# EAGLE design STorM32 NT Display v12 (EAGLE 7.5.0)
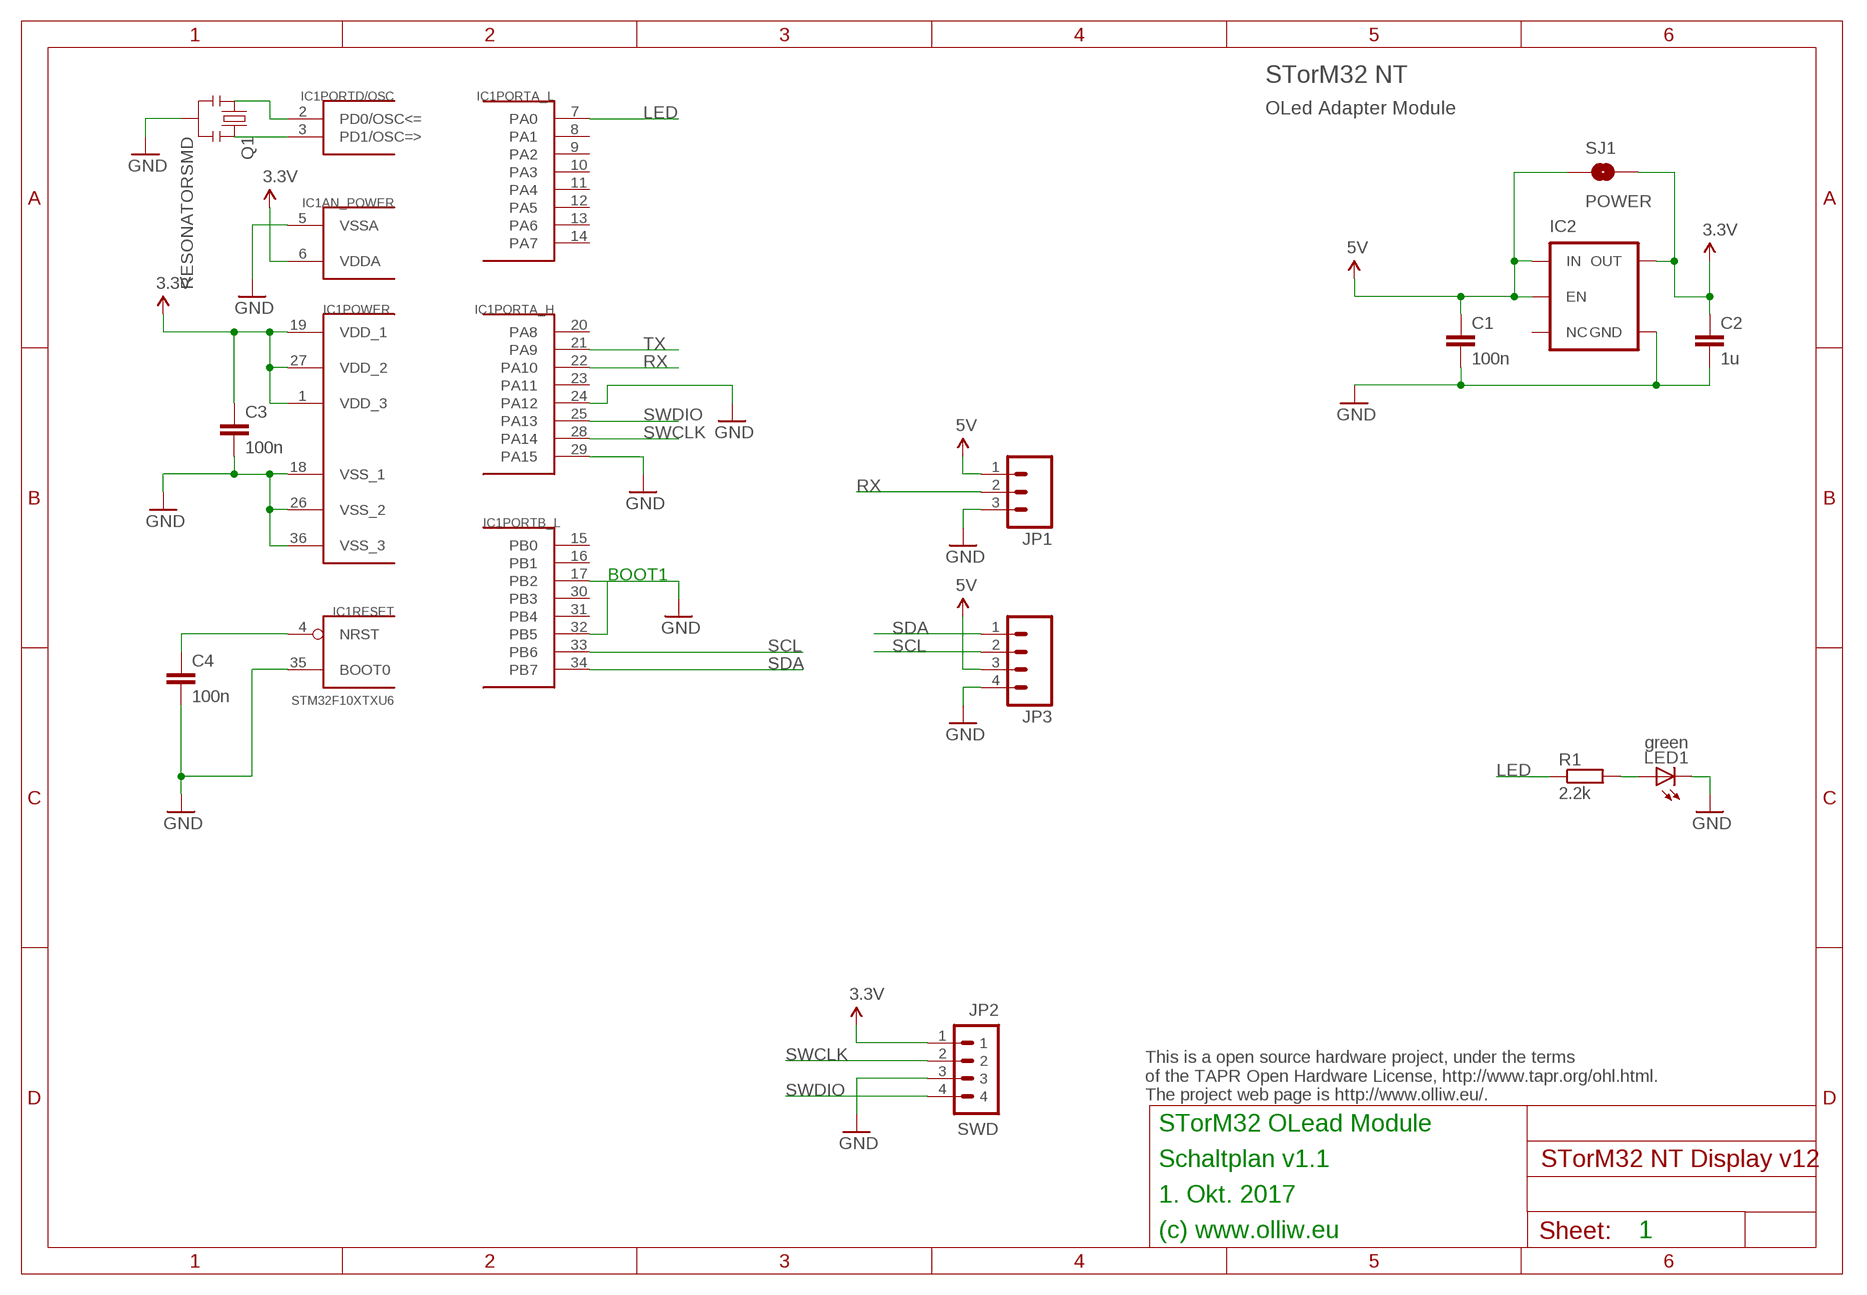
[diagram p0: schematic, sheet 1]

## Parts
C1  100n  C-EUC0603  [C0603]
C2  1u  C-EUC0603  [C0603]
C3  100n  C-EUC0603  [C0603]
C4  100n  C-EUC0603  [C0603]
IC1  STM32F10XTXU6  [VFQFPN36]
IC2  V_REG_TPS76433SOT23-5  [SOT23-5]
JP1  M03PTH  [1X03]
JP2  SWD  P4X1_1P27-OCT_BILEX  [4X1_1P27_OCT_BILEX]
JP3  M04PTH  [1X04]
LED1  green  LEDCHIPLED_0603  [CHIPLED_0603]
Q1  RESONATORSMD  [RESONATOR-SMD]
R1  2.2k  R-EU_R0603  [R0603]
SJ1  POWER  SOLDERJUMPERNO  [SJ_2S-NO]

## Nets
3.3V: C2.1 C3.1 IC1.1(POWER:VDD_3) IC1.6(AN_POWER:VDDA) IC1.19(POWER:VDD_1) IC1.27(POWER:VDD_2) IC2.5(OUT) JP2.1 SJ1.2
5V: C1.1 IC2.1(IN) IC2.3(EN) JP1.1 JP3.3 SJ1.1
GND: C1.2 C2.2 C3.2 C4.2 IC1.5(AN_POWER:VSSA) IC1.17(PORTB_L:PB2) IC1.18(POWER:VSS_1) IC1.24(PORTA_H:PA12) IC1.26(POWER:VSS_2) IC1.29(PORTA_H:PA15) IC1.32(PORTB_L:PB5) IC1.35(RESET:BOOT0) IC1.36(POWER:VSS_3) IC2.2(GND) JP1.3 JP2.3 JP3.4 LED1.C Q1.2
LED: IC1.7(PORTA_L:PA0) R1.1
N$1: C4.1 IC1.4(RESET:NRST)
N$2: LED1.A R1.2
N$5: IC1.2(PORTD/OSC:PD0/OSC<=) Q1.1
N$6: IC1.3(PORTD/OSC:PD1/OSC=>) Q1.3
RX: IC1.22(PORTA_H:PA10) JP1.2
SCL: IC1.33(PORTB_L:PB6) JP3.2
SDA: IC1.34(PORTB_L:PB7) JP3.1
SWCLK: IC1.28(PORTA_H:PA14) JP2.2
SWDIO: IC1.25(PORTA_H:PA13) JP2.4
TX: IC1.21(PORTA_H:PA9)
Unconnected: IC1.8(PORTA_L:PA1) IC1.9(PORTA_L:PA2) IC1.10(PORTA_L:PA3) IC1.11(PORTA_L:PA4) IC1.12(PORTA_L:PA5) IC1.13(PORTA_L:PA6) IC1.14(PORTA_L:PA7) IC1.15(PORTB_L:PB0) IC1.16(PORTB_L:PB1) IC1.20(PORTA_H:PA8) IC1.23(PORTA_H:PA11) IC1.30(PORTB_L:PB3) IC1.31(PORTB_L:PB4) IC2.4(NC)

## Notes on the sheet
- STorM32 NT
- OLed Adapter Module
- BOOT1
- This is a open source hardware project, under the terms
  of the TAPR Open Hardware License, http://www.tapr.org/ohl.html.
  The project web page is http://www.olliw.eu/.
- STorM32 OLead Module
- Schaltplan v1.1
- 1. Okt. 2017
- (c) www.olliw.eu | 1

## Library data of the parts
C1-C4 = rcl:C-EU: CAPACITOR, European symbol
IC1 = # stm32:STM32F10XTXU6: STM32F101/103 36pad VFQPFN36
IC2 = # SparkFun2:V_REG_TPS76433: Voltage Regulator Older TI part. LDO 150mA regulator. No output by-pass cap option. See V_REG_LDO for a better part.
JP1 = # SparkFun2:M03: Header 3 Standard 3-pin 0.1" header. Use with straight break away headers (SKU : PRT-00116), right angle break away headers (PRT-00553), swiss pins (PRT-00743), machine pins (PRT-00117), and female headers (PRT-00115). Molex polarized connector foot print use with SKU : PRT-08232 with associated crimp pins and housings.
JP2 = # stdlib:P4X1_1P27
JP3 = # SparkFun2:M04: Header 4 Standard 4-pin 0.1" header. Use with straight break away headers (SKU : PRT-00116), right angle break away headers (PRT-00553), swiss pins (PRT-00743), machine pins (PRT-00117), and female headers (PRT-00115). Molex polarized connector foot print use with SKU : PRT-08231 with associated crimp pins and housings. 1MM SMD Version SKU: PRT-10208
LED1 = led:LED: LED OSRAM: - CHIPLED LG R971, LG N971, LY N971, LG Q971, LY Q971, LO R971, LY R971 LH N974, LH R974 LS Q976, LO Q976, LY Q976 LO Q996 - Hyper CHIPLED LW Q18S LB Q993, LB Q99A, LB R99A - SideLED LS A670, LO A670, LY A670, LG A670, LP A670 LB A673, LV A673, LT A673, LW A673 LH A674 LY A675 LS A676, LA A676, LO A676, LY A676, LW A676 LS A679, LY A679, LG A679 - Hyper Micro SIDELED® LS Y876, LA Y876, LO Y876, LY Y876 LT Y87S - SmartLED LW L88C, LW L88S LB L89C, LB L89S, LG L890 LS L89K, LO L89K, LY L89K LS L896, LA L896, LO L896, LY L896 - TOPLED LS T670, LO T670, LY T670, LG T670, LP T670 LSG T670, LSP T670, LSY T670, LOP T670, LYG T670 LG T671, LOG T671, LSG T671 LB T673, LV T673, LT T673, LW T673 LH T674 LS T676, LA T676, LO T676, LY T676, LB T676, LH T676, LSB T676, LW T676 LB T67C, LV T67C, LT T67C, LS T67K, LO T67K, LY T67K, LW E67C LS E67B, LA E67B, LO E67B, LY E67B, LB E67C, LV E67C, LT E67C LW T67C LS T679, LY T679, LG T679 LS T770, LO T770, LY T770, LG T770, LP T770 LB T773, LV T773, LT T773, LW T773 LH T774 LS E675, LA E675, LY E675, LS T675 LS T776, LA T776, LO T776, LY T776, LB T776 LHGB T686 LT T68C, LB T68C - Hyper Mini TOPLED® LB M676 - Mini TOPLED Santana® LG M470 LS M47K, LO M47K, LY M47K Source: http://www.osram.convergy.de LUXEON: - LUMILED® LXK2-PW12-R00, LXK2-PW12-S00, LXK2-PW14-U00, LXK2-PW14-V00 LXK2-PM12-R00, LXK2-PM12-S00, LXK2-PM14-U00 LXK2-PE12-Q00, LXK2-PE12-R00, LXK2-PE12-S00, LXK2-PE14-T00, LXK2-PE14-U00 LXK2-PB12-K00, LXK2-PB12-L00, LXK2-PB12-M00, LXK2-PB14-N00, LXK2-PB14-P00, LXK2-PB14-Q00 LXK2-PR12-L00, LXK2-PR12-M00, LXK2-PR14-Q00, LXK2-PR14-R00 LXK2-PD12-Q00, LXK2-PD12-R00, LXK2-PD12-S00 LXK2-PH12-R00, LXK2-PH12-S00 LXK2-PL12-P00, LXK2-PL12-Q00, LXK2-PL12-R00 Source: www.luxeon.com KINGBRIGHT: KA-3528ASYC Source: www.kingbright.com
Q1 = # SparkFun2:RESONATOR: Resonator Small SMD resonator. This is the itty bitty 10/20MHz resonators with built in caps. CSTCE10M0G55 and CSTCE20M0V53. Footprint has been reviewed closely but hasn't been tested yet.
R1 = rcl:R-EU_: RESISTOR, European symbol
SJ1 = # SparkFun2:SOLDERJUMPER: Solder Jumper Standard SMD solder jumper. Used to automate production. Two varients : Normally Open and Normally Closed are the same, but have different paste layers. NC will have a large amount of paste and should jumper during reflow.

## Board
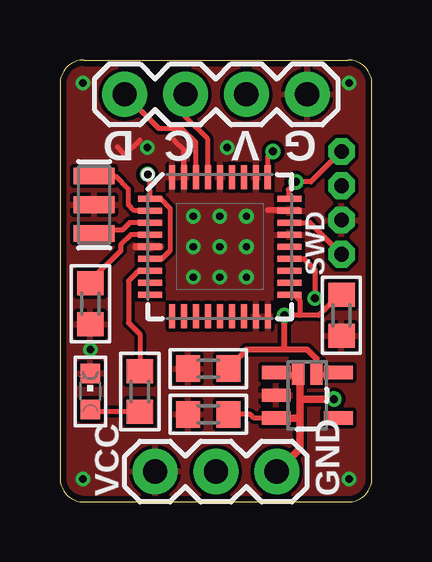
[diagram p1: board, top side]
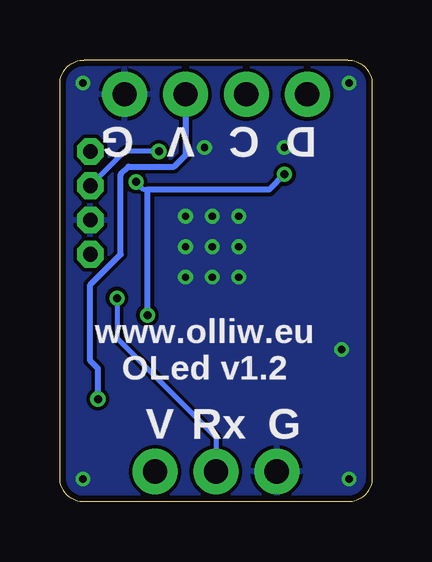
[diagram p2: board, bottom side, seen from below]

Size 13.02 x 18.41 mm. Coordinates in mm from the lower left corner, seen from the top.
Outline: 1,18.41 12.02,18.41 arc-90 13.02,17.41 13.02,1 arc-90 12.02,0 1,0 arc-90 0,1 0,17.41 arc-90 1,18.41
Copper layers (1*16): Top 0.035mm / dielectric 1.5mm / Bottom 0.035mm
Design rules "Fusion_eagle_rule_v1.1-shapes-supply-changed": minimum track width 6mil, minimum drill 12mil, track to track 6mil, track to pad 6mil, pad to pad 6mil, via to via 6mil, smd to smd 0mil, copper to edge 10mil, drill to drill 10mil, minimum pad ring 10mil, minimum via ring 6mil, stop-mask expansion 2mil, vias tented up to drill 100mil, thermal gap 6mil

### Footprints (pad centres in the part's own frame; a part is rotated, then mirrored left to right if it is on the bottom)
C0603 = smd 1 x 1.1: 1 -0.85,0; 2 0.85,0
VFQFPN36 = smd 1 x 0.25: 1 -2.9,2; 2 -2.9,1.5; 3 -2.9,1; 4 -2.9,0.5; 5 -2.9,0; 6 -2.9,-0.5; 7 -2.9,-1; 8 -2.9,-1.5; 9 -2.9,-2; 19 2.9,-2; 20 2.9,-1.5; 21 2.9,-1; 22 2.9,-0.5; 23 2.9,0; 24 2.9,0.5; 25 2.9,1; 26 2.9,1.5; 27 2.9,2 | smd 0.25 x 1: 10 -2,-2.9; 11 -1.5,-2.9; 12 -1,-2.9; 13 -0.5,-2.9; 14 0,-2.9; 15 0.5,-2.9; 16 1,-2.9; 17 1.5,-2.9; 18 2,-2.9; 29 1.5,2.9; 30 1,2.9; 31 0.5,2.9; 32 0,2.9; 33 -0.5,2.9; 34 -1,2.9; 35 -1.5,2.9; 36 -2,2.9 | smd 0.27 x 1: 28 2,2.9
SOT23-5 = smd 0.55 x 1.2: 1 -0.95,-1.3; 2 0,-1.3; 3 0.95,-1.3; 4 0.95,1.3; 5 -0.95,1.3
1X03 = drill 1.016 pad 1.88: 1 0,0; 2 2.54,0; 3 5.08,0
4X1_1P27_OCT_BILEX = drill 0.61 pad 1.118 octagon: 1 0,0; 2 0,-1.429; 3 0,-2.857; 4 0,-4.286
1X04 = drill 1.016 pad 1.88: 1 0,0; 2 2.54,0; 3 5.08,0; 4 7.62,0
CHIPLED_0603 = smd 0.8 x 0.8: A 0,-0.75; C 0,0.75
RESONATOR-SMD = smd 0.7 x 1.7: 1 -1.2,0; 2 0,0; 3 1.2,0
R0603 = smd 1 x 1.1: 1 -0.85,0; 2 0.85,0
SJ_2S-NO = smd 0.508 x 1.016: 1 -0.381,0; 2 0.381,0

### Placement (x,y rotation side)
C1  6.19,3.65 180 top
C2  6.19,5.56 180 top
C3  11.75,7.78 270 top
C4  1.27,8.26 270 top
IC1  6.67,10.64 0 top
IC2  10.32,4.45 270 top
JP1  9.05,1.27 180 top
JP2  11.75,14.61 0 top
JP3  2.7,16.99 0 top
LED1  1.27,4.6 0 top
Q1  1.43,12.38 270 top
R1  3.33,4.6 270 top
SJ1  10.32,5.4 0 top

### Tracks (layer width: path | path; a pad name or v marks a point on that pad's centre or on a via)
3.3V  (via drill 0.33)
  Top 0.203: C3.1 11.34,8.32 10.79,7.78 10,7.78 | IC1.6 4.26,10.14 4.6,10.48 4.6,12.22 4.19,12.64 IC1.1 3.77,13.54 v3.65,13.65 | 7.14,5.71 7.14,5.66 C2.1 | 9.78,12.64 IC1.27 9.53,12.68 9.53,13.02 v9.84,13.34 10.48,13.34 JP2.1 | 10.7,5.24 SJ1.2 | 10,7.78 v9.37,7.78 9.37,7.83 | IC1.19 9.78,8.64 10,8.41 10,7.78
  Top 0.254: SJ1.2 10.7,5.97 10.32,6.35 9.37,6.35 | 9.37,6.35 7.78,6.35 7.14,5.71 | 9.37,6.35 v9.37,7.78 | IC2.5 10.7,5.24
  Bottom 0.203: 9.37,13.02 9.53,13.02 v9.84,13.34
  Bottom 0.254: v9.37,7.78 9.37,13.02 4.29,13.02 v3.65,13.65
5V  (via drill 0.33)
  Top 0.203: 9.94,5.24 SJ1.1 10,5.17 | IC2.3 8.09,3.5 7.94,3.65 C1.1
  Top 0.305: IC2.1 9.94,5.24 | IC2.3 10,3.5 | 10,3.5 10,3.65 10,4.29 | 10,4.29 10,5.17 | JP1.1 10,2.22 10,3.18 10,3.5 | v11.43,4.29 10,4.29
  Bottom 0.254: v11.43,4.29 11.43,5.56 11.75,5.87 11.75,9.05 10.48,10.32 10.48,13.65 10.16,13.97 8.26,13.97 7.78,14.45 JP3.3
GND  (via drill 0.3 pad 0.61)
  Top 0.152: IC1.17 8.3,7.74 8.33,7.7 | 4.6,13.53 4.61,13.7 IC1.36
  Top 0.203: 4.76,15.08 5.17,14.68 IC1.35 | 2.4,14.78 2.7,14.45 3.33,15.08
  Top 0.254: 9.96,12.15 8.69,12.15
  Top 0.305: 3.17,10.64 4.13,10.64
  other vias: 6.67,11.91 5.56,11.91 7.78,9.37 7.78,10.64 7.78,11.91 5.56,9.37 6.67,9.37 6.67,10.64 5.56,10.64 1.27,6.35 0.95,0.95 12.06,0.95 0.95,17.46 12.06,17.46 3.65,14.76 6.99,14.76
  pour Bottom (isolate 0.152, rank 2): 0.33,17.48 arc-90 1,18.15 12.1,18.15 arc-90 12.77,17.48 12.77,1 arc-90 12.1,0.33 1,0.33 arc-90 0.33,1
  pour Top (isolate 0.152, rank 2): 0.33,17.48 arc-90 1,18.15 12.1,18.15 arc-90 12.77,17.48 12.77,1 arc-90 12.1,0.33 1,0.33 arc-90 0.33,1
LED
  Top 0.203: IC1.7 3.29,9.64 2.86,9.21 2.86,7.46 3.33,6.99 R1.1
N$1
  Top 0.203: IC1.4 2.96,11.14 2.54,10.72 2.54,10.48 1.27,9.21 C4.1
N$2
  Top 0.203: R1.2 1.53,3.75 LED1.A
N$5
  Top 0.203: IC1.2 3.1,12.14 2.86,12.38 2.86,13.02 2.29,13.58 Q1.1
N$6
  Top 0.203: IC1.3 2.9,11.64 2.61,11.34 1.59,11.34 1.59,11.27 Q1.3
RX  (via drill 0.33)
  Top 0.203: IC1.22 10.18,10.14 10.64,9.68 v10.64,8.49
  Bottom 0.203: v10.64,8.49 10.64,6.83 6.51,2.7 JP1.2
SCL
  Top 0.203: IC1.33 6.17,15.11 5.24,16.03 JP3.2
SDA
  Top 0.203: IC1.34 5.67,14.97 5.08,15.56 4.13,15.56 JP3.1
SWCLK  (via drill 0.33)
  Top 0.203: IC1.28 8.67,14.38 v8.89,14.61
  Bottom 0.203: v8.89,14.61 10.32,14.61 JP2.2
SWDIO
  Top 0.203: IC1.25 10.43,11.64 JP2.4

### Text on the board
tNames: D | C | V | G | SWD | VCC | GND
bNames: D | C | V | G | www.olliw.eu / OLed v1.2 | G | Rx | V